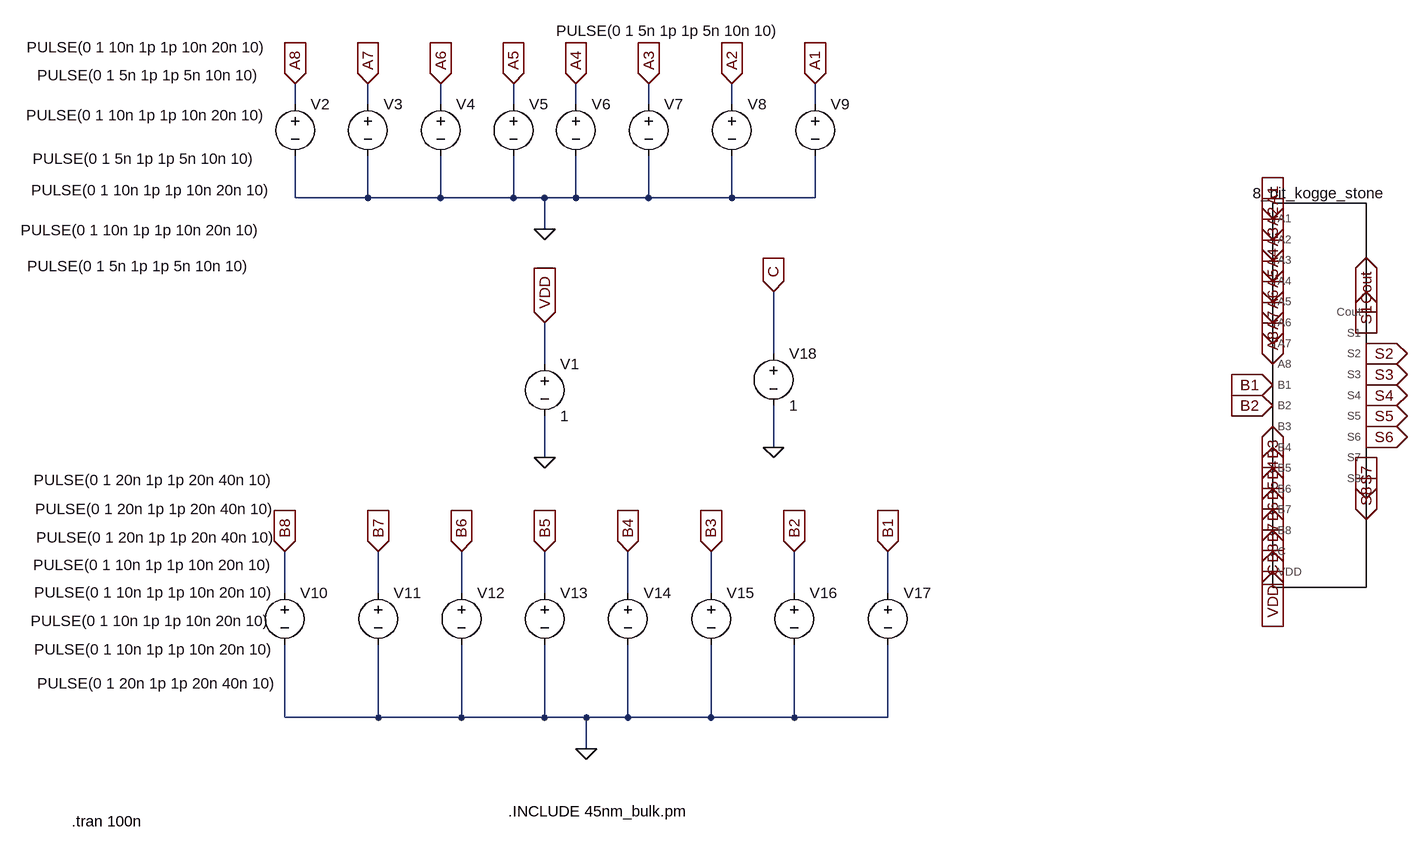
[diagram p0: schematic final_symbol_kogge_schematic.asc]
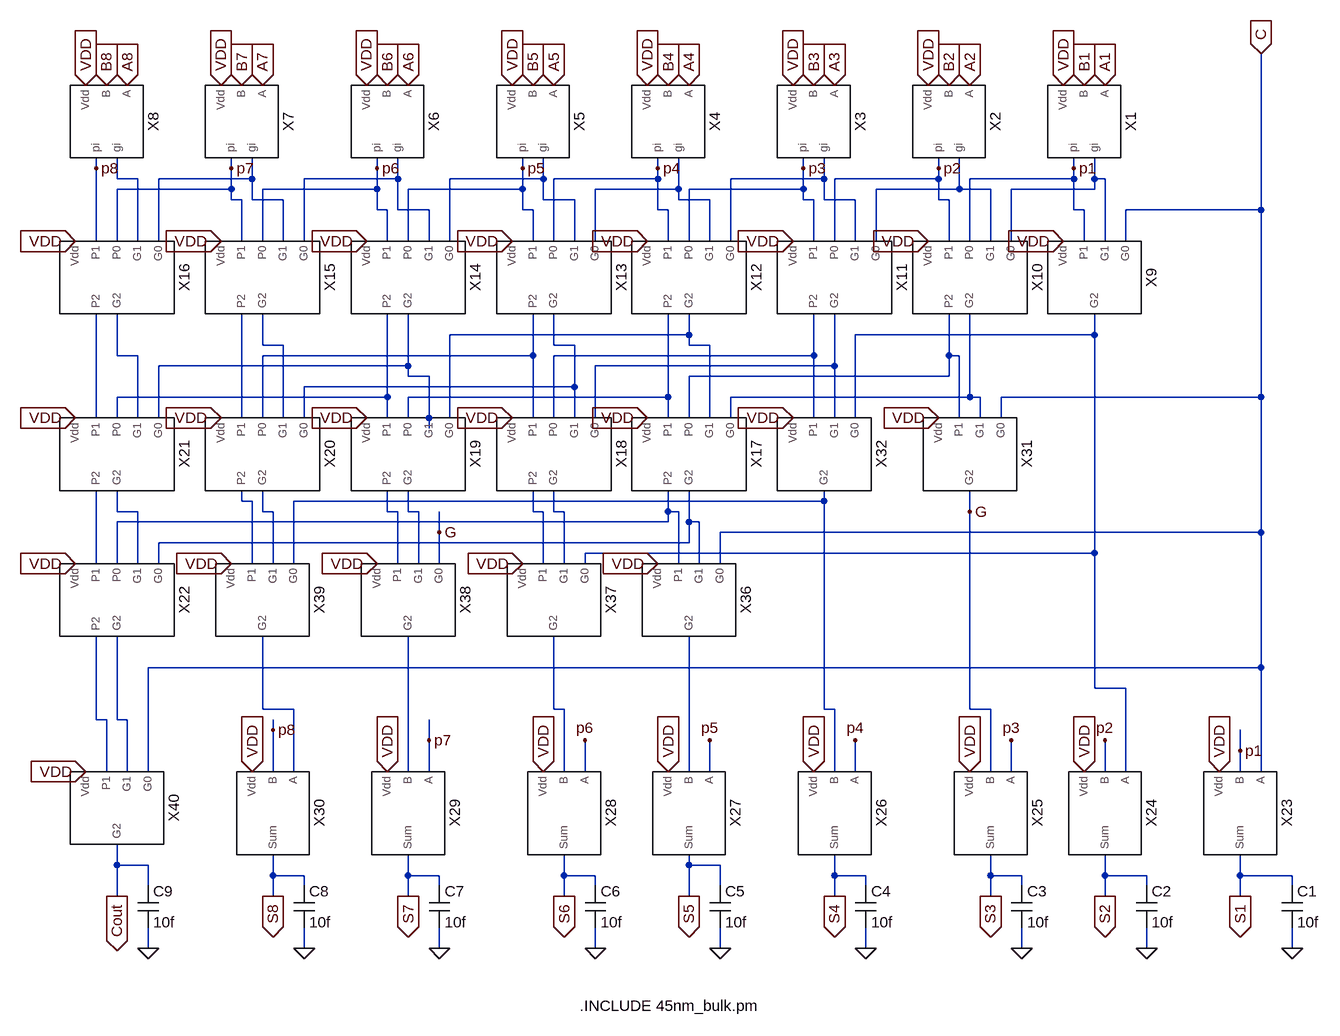
[diagram p1: sub-circuit 8bit_kogge_stone_final.asc]
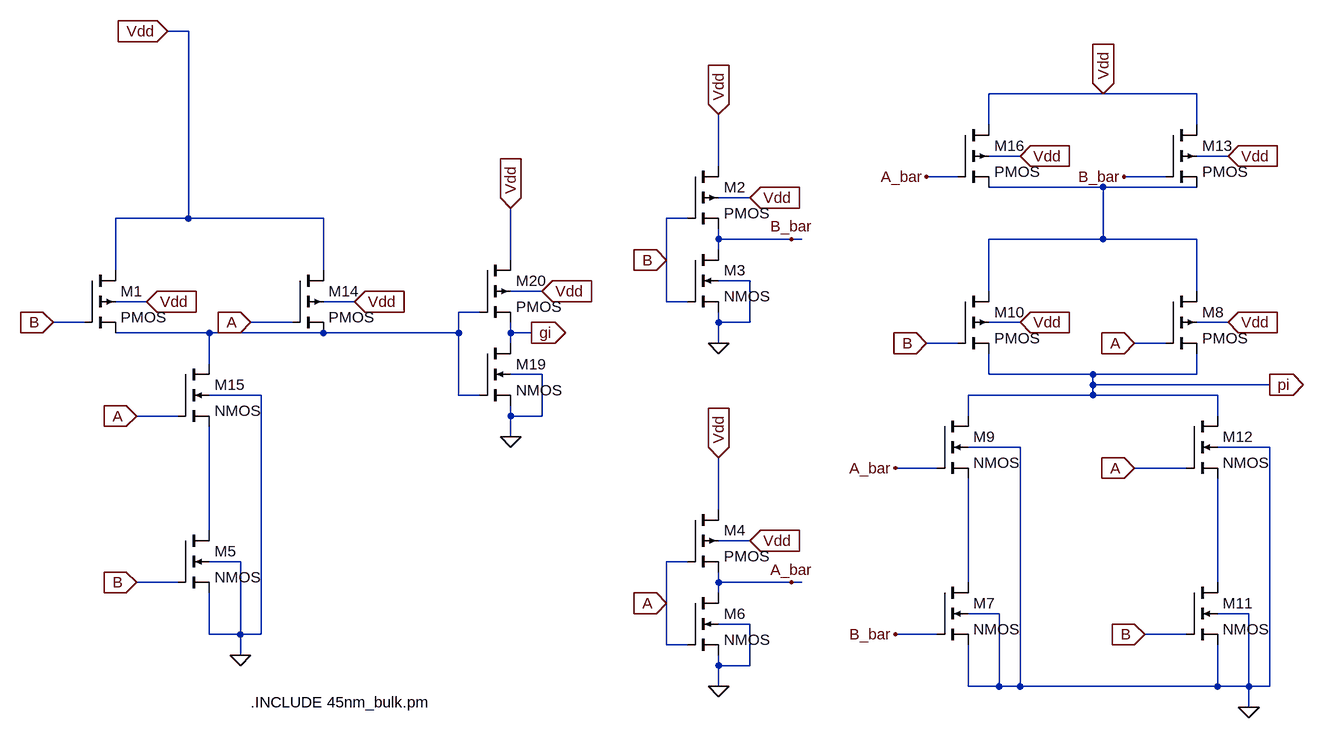
[diagram p2: sub-circuit bit_prop_gen.asc]
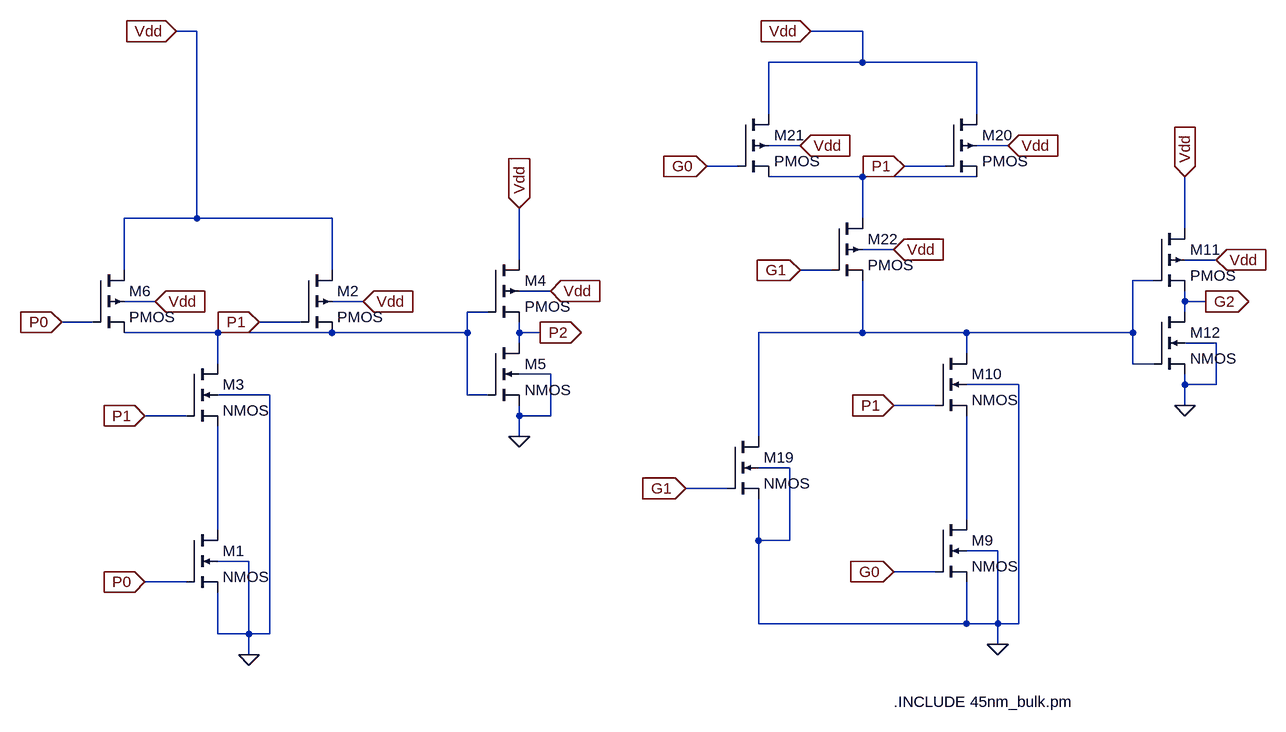
[diagram p3: sub-circuit group_prop_generate_both.asc]
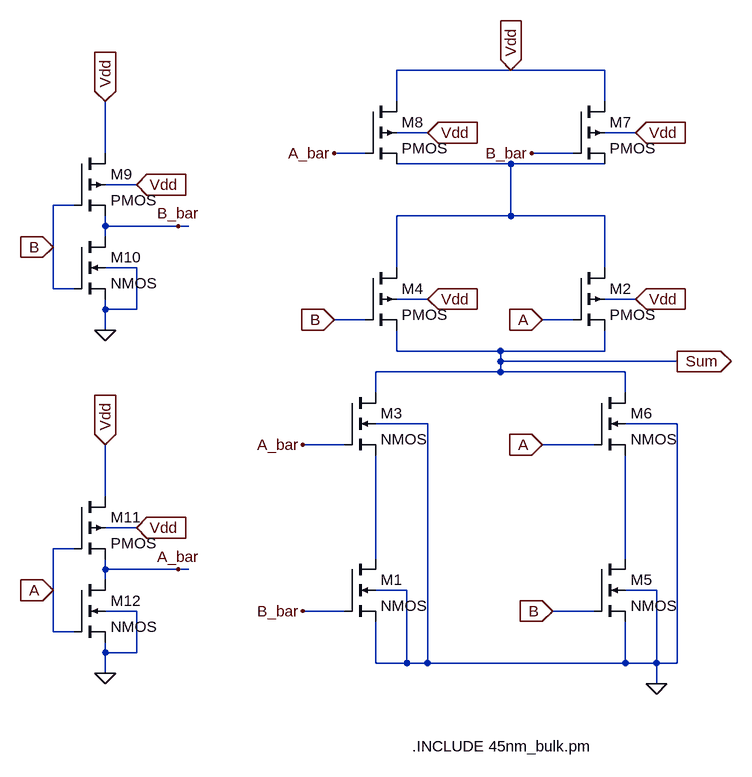
[diagram p4: sub-circuit xor_post_comp_sum.asc]
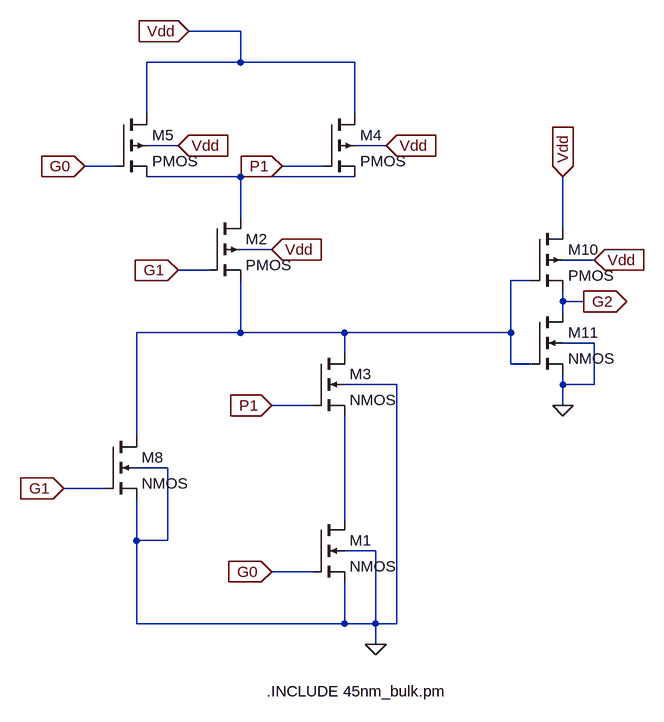
[diagram p5: sub-circuit group_generation.asc]
final_symbol_kogge_schematic.asc, the LTspice schematic file:
Version 4
SHEET 1 1920 1224
WIRE -384 -128 -384 -160
WIRE -272 -128 -272 -160
WIRE -160 -128 -160 -160
WIRE -48 -128 -48 -160
WIRE 48 -128 48 -160
WIRE 160 -128 160 -160
WIRE 288 -128 288 -160
WIRE 416 -128 416 -160
WIRE -384 16 -384 -48
WIRE -272 16 -272 -48
WIRE -272 16 -384 16
WIRE -160 16 -160 -48
WIRE -160 16 -272 16
WIRE -48 16 -48 -48
WIRE -48 16 -160 16
WIRE 0 16 -48 16
WIRE 48 16 48 -48
WIRE 48 16 0 16
WIRE 160 16 160 -48
WIRE 160 16 48 16
WIRE 288 16 288 -48
WIRE 288 16 160 16
WIRE 416 16 416 -48
WIRE 416 16 288 16
WIRE 0 64 0 16
WIRE 352 256 352 160
WIRE 0 272 0 208
WIRE 352 400 352 336
WIRE 0 416 0 352
WIRE -400 624 -400 560
WIRE -256 624 -256 560
WIRE -128 624 -128 560
WIRE 0 624 0 560
WIRE 128 624 128 560
WIRE 256 624 256 560
WIRE 384 624 384 560
WIRE 528 624 528 560
WIRE -400 816 -400 704
WIRE -256 816 -256 704
WIRE -256 816 -400 816
WIRE -128 816 -128 704
WIRE -128 816 -256 816
WIRE 0 816 0 704
WIRE 0 816 -128 816
WIRE 64 816 0 816
WIRE 128 816 128 704
WIRE 128 816 64 816
WIRE 256 816 256 704
WIRE 256 816 128 816
WIRE 384 816 384 704
WIRE 384 816 256 816
WIRE 528 816 528 704
WIRE 528 816 384 816
WIRE 64 864 64 816
FLAG 0 416 0
FLAG 0 208 VDD
IOPIN 0 208 In
FLAG 0 64 0
FLAG 416 -160 A1
IOPIN 416 -160 In
FLAG 288 -160 A2
IOPIN 288 -160 In
FLAG 160 -160 A3
IOPIN 160 -160 In
FLAG 48 -160 A4
IOPIN 48 -160 In
FLAG -48 -160 A5
IOPIN -48 -160 In
FLAG -160 -160 A6
IOPIN -160 -160 In
FLAG -272 -160 A7
IOPIN -272 -160 In
FLAG -384 -160 A8
IOPIN -384 -160 In
FLAG 64 864 0
FLAG 528 560 B1
IOPIN 528 560 In
FLAG 384 560 B2
IOPIN 384 560 In
FLAG 256 560 B3
IOPIN 256 560 In
FLAG 128 560 B4
IOPIN 128 560 In
FLAG 0 560 B5
IOPIN 0 560 In
FLAG -128 560 B6
IOPIN -128 560 In
FLAG -256 560 B7
IOPIN -256 560 In
FLAG -400 560 B8
IOPIN -400 560 In
FLAG 352 400 0
FLAG 352 160 C
IOPIN 352 160 In
FLAG 1120 48 A1
IOPIN 1120 48 In
FLAG 1120 80 A2
IOPIN 1120 80 In
FLAG 1120 112 A3
IOPIN 1120 112 In
FLAG 1120 144 A4
IOPIN 1120 144 In
FLAG 1120 176 A5
IOPIN 1120 176 In
FLAG 1120 208 A6
IOPIN 1120 208 In
FLAG 1120 240 A7
IOPIN 1120 240 In
FLAG 1120 272 A8
IOPIN 1120 272 In
FLAG 1120 304 B1
IOPIN 1120 304 In
FLAG 1120 336 B2
IOPIN 1120 336 In
FLAG 1120 368 B3
IOPIN 1120 368 In
FLAG 1120 400 B4
IOPIN 1120 400 In
FLAG 1120 432 B5
IOPIN 1120 432 In
FLAG 1120 464 B6
IOPIN 1120 464 In
FLAG 1120 496 B7
IOPIN 1120 496 In
FLAG 1120 528 B8
IOPIN 1120 528 In
FLAG 1120 560 C
IOPIN 1120 560 In
FLAG 1120 592 VDD
IOPIN 1120 592 In
FLAG 1264 192 Cout
IOPIN 1264 192 Out
FLAG 1264 224 S1
IOPIN 1264 224 Out
FLAG 1264 256 S2
IOPIN 1264 256 Out
FLAG 1264 288 S3
IOPIN 1264 288 Out
FLAG 1264 320 S4
IOPIN 1264 320 Out
FLAG 1264 384 S6
IOPIN 1264 384 Out
FLAG 1264 416 S7
IOPIN 1264 416 Out
FLAG 1264 448 S8
IOPIN 1264 448 Out
FLAG 1264 352 S5
IOPIN 1264 352 Out
SYMBOL voltage 0 256 R0
WINDOW 123 0 0 Left 0
WINDOW 39 0 0 Left 0
SYMATTR InstName V1
SYMATTR Value 1
SYMBOL voltage -384 -144 R0
WINDOW 3 -414 33 Left 2
WINDOW 123 0 0 Left 0
WINDOW 39 0 0 Left 0
SYMATTR Value PULSE(0 1 10n 1p 1p 10n 20n 10)
SYMATTR InstName V2
SYMBOL voltage -272 -144 R0
WINDOW 3 -509 -29 Left 2
WINDOW 123 0 0 Left 0
WINDOW 39 0 0 Left 0
SYMATTR Value PULSE(0 1 5n 1p 1p 5n 10n 10)
SYMATTR InstName V3
SYMBOL voltage -160 -144 R0
WINDOW 3 -646 210 Left 2
WINDOW 123 0 0 Left 0
WINDOW 39 0 0 Left 0
SYMATTR Value PULSE(0 1 10n 1p 1p 10n 20n 10)
SYMATTR InstName V4
SYMBOL voltage -48 -144 R0
WINDOW 3 -740 100 Left 2
WINDOW 123 0 0 Left 0
WINDOW 39 0 0 Left 0
SYMATTR Value PULSE(0 1 5n 1p 1p 5n 10n 10)
SYMATTR InstName V5
SYMBOL voltage 48 -144 R0
WINDOW 3 -838 148 Left 2
WINDOW 123 0 0 Left 0
WINDOW 39 0 0 Left 0
SYMATTR Value PULSE(0 1 10n 1p 1p 10n 20n 10)
SYMATTR InstName V6
SYMBOL voltage 160 -144 R0
WINDOW 3 -142 -97 Left 2
WINDOW 123 0 0 Left 0
WINDOW 39 0 0 Left 0
SYMATTR Value PULSE(0 1 5n 1p 1p 5n 10n 10)
SYMATTR InstName V7
SYMBOL voltage 288 -144 R0
WINDOW 3 -1085 -72 Left 2
WINDOW 123 0 0 Left 0
WINDOW 39 0 0 Left 0
SYMATTR Value PULSE(0 1 10n 1p 1p 10n 20n 10)
SYMATTR InstName V8
SYMBOL voltage 416 -144 R0
WINDOW 123 0 0 Left 0
WINDOW 39 0 0 Left 0
WINDOW 3 -1212 265 Left 2
SYMATTR InstName V9
SYMATTR Value PULSE(0 1 5n 1p 1p 5n 10n 10)
SYMBOL voltage -400 608 R0
WINDOW 3 -384 -113 Left 2
WINDOW 123 0 0 Left 0
WINDOW 39 0 0 Left 0
SYMATTR Value PULSE(0 1 20n 1p 1p 20n 40n 10)
SYMATTR InstName V10
SYMBOL voltage -256 608 R0
WINDOW 3 -535 59 Left 2
WINDOW 123 0 0 Left 0
WINDOW 39 0 0 Left 0
SYMATTR Value PULSE(0 1 10n 1p 1p 10n 20n 10)
SYMATTR InstName V11
SYMBOL voltage -128 608 R0
WINDOW 3 -658 -158 Left 2
WINDOW 123 0 0 Left 0
WINDOW 39 0 0 Left 0
SYMATTR Value PULSE(0 1 20n 1p 1p 20n 40n 10)
SYMATTR InstName V12
SYMBOL voltage 0 608 R0
WINDOW 3 -785 15 Left 2
WINDOW 123 0 0 Left 0
WINDOW 39 0 0 Left 0
SYMATTR Value PULSE(0 1 10n 1p 1p 10n 20n 10)
SYMATTR InstName V13
SYMBOL voltage 128 608 R0
WINDOW 3 -910 -69 Left 2
WINDOW 123 0 0 Left 0
WINDOW 39 0 0 Left 0
SYMATTR Value PULSE(0 1 20n 1p 1p 20n 40n 10)
SYMATTR InstName V14
SYMBOL voltage 256 608 R0
WINDOW 3 -1041 103 Left 2
WINDOW 123 0 0 Left 0
WINDOW 39 0 0 Left 0
SYMATTR Value PULSE(0 1 10n 1p 1p 10n 20n 10)
SYMATTR InstName V15
SYMBOL voltage 384 608 R0
WINDOW 3 -1165 155 Left 2
WINDOW 123 0 0 Left 0
WINDOW 39 0 0 Left 0
SYMATTR Value PULSE(0 1 20n 1p 1p 20n 40n 10)
SYMATTR InstName V16
SYMBOL voltage 528 608 R0
WINDOW 3 -1315 -27 Left 2
WINDOW 123 0 0 Left 0
WINDOW 39 0 0 Left 0
SYMATTR Value PULSE(0 1 10n 1p 1p 10n 20n 10)
SYMATTR InstName V17
SYMBOL voltage 352 240 R0
WINDOW 123 0 0 Left 0
WINDOW 39 0 0 Left 0
SYMATTR InstName V18
SYMATTR Value 1
SYMBOL 8BIT_KOGGE_STONE_FINAL 1184 320 R0
SYMATTR InstName 8_bit_kogge_stone
TEXT -56 960 Left 2 !.INCLUDE 45nm_bulk.pm
TEXT -728 976 Left 2 !.tran 100n

8bit_kogge_stone_final.asc, the sub-circuit schematic file:
Version 4
SHEET 1 1136 680
WIRE -752 -3680 -752 -3696
WIRE -544 -3680 -544 -3696
WIRE -320 -3680 -320 -3696
WIRE -96 -3680 -96 -3696
WIRE 112 -3680 112 -3696
WIRE 336 -3680 336 -3696
WIRE 544 -3680 544 -3696
WIRE 752 -3680 752 -3696
WIRE -720 -3664 -720 -3696
WIRE -688 -3664 -720 -3664
WIRE -512 -3664 -512 -3696
WIRE -512 -3664 -656 -3664
WIRE -288 -3664 -288 -3696
WIRE -288 -3664 -432 -3664
WIRE -64 -3664 -64 -3696
WIRE -64 -3664 -208 -3664
WIRE 112 -3664 112 -3680
WIRE 112 -3664 -48 -3664
WIRE 368 -3664 368 -3696
WIRE 368 -3664 224 -3664
WIRE 544 -3664 544 -3680
WIRE 544 -3664 384 -3664
WIRE 752 -3664 752 -3680
WIRE 752 -3664 592 -3664
WIRE 784 -3664 784 -3696
WIRE 800 -3664 784 -3664
WIRE -544 -3648 -544 -3680
WIRE -544 -3648 -720 -3648
WIRE -320 -3648 -320 -3680
WIRE -320 -3648 -496 -3648
WIRE -96 -3648 -96 -3680
WIRE -96 -3648 -272 -3648
WIRE 144 -3648 144 -3696
WIRE 144 -3648 16 -3648
WIRE 336 -3648 336 -3680
WIRE 336 -3648 160 -3648
WIRE 576 -3648 576 -3696
WIRE 576 -3648 448 -3648
WIRE 624 -3648 576 -3648
WIRE 784 -3648 784 -3664
WIRE 784 -3648 656 -3648
WIRE -544 -3632 -544 -3648
WIRE -528 -3632 -544 -3632
WIRE -512 -3632 -512 -3664
WIRE -464 -3632 -512 -3632
WIRE -64 -3632 -64 -3664
WIRE -16 -3632 -64 -3632
WIRE 144 -3632 144 -3648
WIRE 192 -3632 144 -3632
WIRE 336 -3632 336 -3648
WIRE 352 -3632 336 -3632
WIRE 368 -3632 368 -3664
WIRE 416 -3632 368 -3632
WIRE 544 -3632 544 -3664
WIRE 560 -3632 544 -3632
WIRE -320 -3616 -320 -3648
WIRE -304 -3616 -320 -3616
WIRE -288 -3616 -288 -3664
WIRE -240 -3616 -288 -3616
WIRE -96 -3616 -96 -3648
WIRE -80 -3616 -96 -3616
WIRE 112 -3616 112 -3664
WIRE 128 -3616 112 -3616
WIRE 752 -3616 752 -3664
WIRE 768 -3616 752 -3616
WIRE 1040 -3616 1040 -3856
WIRE 1040 -3616 832 -3616
WIRE -752 -3568 -752 -3680
WIRE -720 -3568 -720 -3648
WIRE -688 -3568 -688 -3664
WIRE -656 -3568 -656 -3664
WIRE -528 -3568 -528 -3632
WIRE -496 -3568 -496 -3648
WIRE -464 -3568 -464 -3632
WIRE -432 -3568 -432 -3664
WIRE -304 -3568 -304 -3616
WIRE -272 -3568 -272 -3648
WIRE -240 -3568 -240 -3616
WIRE -208 -3568 -208 -3664
WIRE -80 -3568 -80 -3616
WIRE -48 -3568 -48 -3664
WIRE -16 -3568 -16 -3632
WIRE 16 -3568 16 -3648
WIRE 128 -3568 128 -3616
WIRE 160 -3568 160 -3648
WIRE 192 -3568 192 -3632
WIRE 224 -3568 224 -3664
WIRE 352 -3568 352 -3632
WIRE 384 -3568 384 -3664
WIRE 416 -3568 416 -3632
WIRE 448 -3568 448 -3648
WIRE 560 -3568 560 -3632
WIRE 592 -3568 592 -3664
WIRE 624 -3568 624 -3648
WIRE 656 -3568 656 -3648
WIRE 768 -3568 768 -3616
WIRE 800 -3568 800 -3664
WIRE 832 -3568 832 -3616
WIRE 160 -3424 160 -3456
WIRE 160 -3424 -208 -3424
WIRE 784 -3424 784 -3456
WIRE 784 -3424 416 -3424
WIRE -496 -3408 -496 -3456
WIRE -464 -3408 -496 -3408
WIRE -48 -3408 -48 -3456
WIRE -16 -3408 -48 -3408
WIRE 160 -3408 160 -3424
WIRE 192 -3408 160 -3408
WIRE -720 -3392 -720 -3456
WIRE -688 -3392 -720 -3392
WIRE -80 -3392 -80 -3456
WIRE -80 -3392 -496 -3392
WIRE 352 -3392 352 -3456
WIRE 352 -3392 -48 -3392
WIRE 560 -3392 560 -3456
WIRE 576 -3392 560 -3392
WIRE -272 -3376 -272 -3456
WIRE -272 -3376 -656 -3376
WIRE 384 -3376 384 -3456
WIRE 384 -3376 16 -3376
WIRE -272 -3360 -272 -3376
WIRE -240 -3360 -272 -3360
WIRE 560 -3360 560 -3392
WIRE 560 -3360 160 -3360
WIRE -16 -3344 -16 -3408
WIRE -16 -3344 -432 -3344
WIRE -304 -3328 -304 -3456
WIRE -304 -3328 -720 -3328
WIRE 128 -3328 128 -3456
WIRE 128 -3328 -272 -3328
WIRE 592 -3328 592 -3456
WIRE 592 -3328 224 -3328
WIRE 608 -3328 592 -3328
WIRE 1040 -3328 1040 -3616
WIRE 1040 -3328 640 -3328
WIRE -752 -3296 -752 -3456
WIRE -720 -3296 -720 -3328
WIRE -688 -3296 -688 -3392
WIRE -656 -3296 -656 -3376
WIRE -528 -3296 -528 -3456
WIRE -496 -3296 -496 -3392
WIRE -464 -3296 -464 -3408
WIRE -432 -3296 -432 -3344
WIRE -304 -3296 -304 -3328
WIRE -272 -3296 -272 -3328
WIRE -240 -3296 -240 -3360
WIRE -208 -3296 -208 -3424
WIRE -80 -3296 -80 -3392
WIRE -48 -3296 -48 -3392
WIRE -16 -3296 -16 -3344
WIRE 16 -3296 16 -3376
WIRE 128 -3296 128 -3328
WIRE 160 -3296 160 -3360
WIRE 192 -3296 192 -3408
WIRE 224 -3296 224 -3328
WIRE 352 -3296 352 -3392
WIRE 384 -3296 384 -3376
WIRE 416 -3296 416 -3424
WIRE 576 -3296 576 -3392
WIRE 608 -3296 608 -3328
WIRE 640 -3296 640 -3328
WIRE -240 -3280 -240 -3296
WIRE -528 -3168 -528 -3184
WIRE -512 -3168 -528 -3168
WIRE 368 -3168 368 -3184
WIRE 368 -3168 -448 -3168
WIRE -720 -3152 -720 -3184
WIRE -688 -3152 -720 -3152
WIRE -496 -3152 -496 -3184
WIRE -480 -3152 -496 -3152
WIRE -304 -3152 -304 -3184
WIRE -288 -3152 -304 -3152
WIRE -272 -3152 -272 -3184
WIRE -256 -3152 -272 -3152
WIRE -80 -3152 -80 -3184
WIRE -64 -3152 -80 -3152
WIRE -48 -3152 -48 -3184
WIRE -32 -3152 -48 -3152
WIRE 128 -3152 128 -3184
WIRE 144 -3152 128 -3152
WIRE 592 -3152 592 -3184
WIRE 128 -3136 128 -3152
WIRE 128 -3136 -720 -3136
WIRE 160 -3136 160 -3184
WIRE 176 -3136 160 -3136
WIRE -224 -3120 -224 -3152
WIRE 1040 -3120 1040 -3328
WIRE 1040 -3120 208 -3120
WIRE 160 -3104 160 -3136
WIRE 160 -3104 -656 -3104
WIRE 784 -3088 784 -3424
WIRE 784 -3088 0 -3088
WIRE -752 -3072 -752 -3184
WIRE -720 -3072 -720 -3136
WIRE -688 -3072 -688 -3152
WIRE -656 -3072 -656 -3104
WIRE -512 -3072 -512 -3168
WIRE -480 -3072 -480 -3152
WIRE -448 -3072 -448 -3168
WIRE -288 -3072 -288 -3152
WIRE -256 -3072 -256 -3152
WIRE -224 -3072 -224 -3120
WIRE -64 -3072 -64 -3152
WIRE -32 -3072 -32 -3152
WIRE 0 -3072 0 -3088
WIRE 144 -3072 144 -3152
WIRE 176 -3072 176 -3136
WIRE 208 -3072 208 -3120
WIRE 1040 -2912 1040 -3120
WIRE 1040 -2912 -672 -2912
WIRE 784 -2880 784 -3088
WIRE 832 -2880 784 -2880
WIRE -496 -2848 -496 -2960
WIRE -448 -2848 -496 -2848
WIRE -48 -2848 -48 -2960
WIRE -32 -2848 -48 -2848
WIRE 368 -2848 368 -3168
WIRE 384 -2848 368 -2848
WIRE 592 -2848 592 -3152
WIRE 624 -2848 592 -2848
WIRE -752 -2832 -752 -2960
WIRE -736 -2832 -752 -2832
WIRE -720 -2832 -720 -2960
WIRE -704 -2832 -720 -2832
WIRE -480 -2816 -480 -2832
WIRE -240 -2800 -240 -2832
WIRE 1008 -2784 1008 -2816
WIRE -736 -2752 -736 -2832
WIRE -704 -2752 -704 -2832
WIRE -672 -2752 -672 -2912
WIRE -480 -2752 -480 -2816
WIRE -448 -2752 -448 -2848
WIRE -272 -2752 -272 -2960
WIRE -240 -2752 -240 -2800
WIRE -32 -2752 -32 -2848
WIRE 0 -2752 0 -2800
WIRE 160 -2752 160 -2960
WIRE 192 -2752 192 -2800
WIRE 384 -2752 384 -2848
WIRE 416 -2752 416 -2800
WIRE 624 -2752 624 -2848
WIRE 656 -2752 656 -2800
WIRE 800 -2752 800 -2800
WIRE 832 -2752 832 -2880
WIRE 1008 -2752 1008 -2784
WIRE 1040 -2752 1040 -2912
WIRE -720 -2608 -720 -2640
WIRE -672 -2608 -720 -2608
WIRE 160 -2608 160 -2624
WIRE 208 -2608 160 -2608
WIRE -480 -2592 -480 -2624
WIRE -432 -2592 -480 -2592
WIRE -272 -2592 -272 -2624
WIRE -224 -2592 -272 -2592
WIRE -32 -2592 -32 -2624
WIRE 16 -2592 -32 -2592
WIRE 384 -2592 384 -2624
WIRE 432 -2592 384 -2592
WIRE 624 -2592 624 -2624
WIRE 672 -2592 624 -2592
WIRE 800 -2592 800 -2624
WIRE 864 -2592 800 -2592
WIRE 1008 -2592 1008 -2624
WIRE 1088 -2592 1008 -2592
WIRE -672 -2576 -672 -2608
WIRE -432 -2576 -432 -2592
WIRE -224 -2576 -224 -2592
WIRE 16 -2576 16 -2592
WIRE 208 -2576 208 -2608
WIRE 432 -2576 432 -2592
WIRE 672 -2576 672 -2592
WIRE 864 -2576 864 -2592
WIRE 1088 -2576 1088 -2592
WIRE -720 -2560 -720 -2608
WIRE -480 -2560 -480 -2592
WIRE -272 -2560 -272 -2592
WIRE -32 -2560 -32 -2592
WIRE 160 -2560 160 -2608
WIRE 384 -2560 384 -2592
WIRE 624 -2560 624 -2592
WIRE 800 -2560 800 -2592
WIRE 1008 -2560 1008 -2592
WIRE -672 -2480 -672 -2512
WIRE -432 -2480 -432 -2512
WIRE -224 -2480 -224 -2512
WIRE 16 -2480 16 -2512
WIRE 208 -2480 208 -2512
WIRE 432 -2480 432 -2512
WIRE 672 -2480 672 -2512
WIRE 864 -2480 864 -2512
WIRE 1088 -2480 1088 -2512
FLAG -784 -3568 VDD
IOPIN -784 -3568 In
FLAG -560 -3568 VDD
IOPIN -560 -3568 In
FLAG -336 -3568 VDD
IOPIN -336 -3568 In
FLAG -112 -3568 VDD
IOPIN -112 -3568 In
FLAG 96 -3568 VDD
IOPIN 96 -3568 In
FLAG 320 -3568 VDD
IOPIN 320 -3568 In
FLAG 528 -3568 VDD
IOPIN 528 -3568 In
FLAG -784 -3296 VDD
IOPIN -784 -3296 In
FLAG -560 -3296 VDD
IOPIN -560 -3296 In
FLAG -336 -3296 VDD
IOPIN -336 -3296 In
FLAG -112 -3296 VDD
IOPIN -112 -3296 In
FLAG 96 -3296 VDD
IOPIN 96 -3296 In
FLAG 96 -3808 VDD
IOPIN 96 -3808 In
FLAG -112 -3808 VDD
IOPIN -112 -3808 In
FLAG -336 -3808 VDD
IOPIN -336 -3808 In
FLAG -560 -3808 VDD
IOPIN -560 -3808 In
FLAG -768 -3808 VDD
IOPIN -768 -3808 In
FLAG 320 -3808 VDD
IOPIN 320 -3808 In
FLAG 528 -3808 VDD
IOPIN 528 -3808 In
FLAG 736 -3808 VDD
IOPIN 736 -3808 In
FLAG -784 -3072 VDD
IOPIN -784 -3072 In
FLAG -512 -2752 VDD
IOPIN -512 -2752 In
FLAG -304 -2752 VDD
IOPIN -304 -2752 In
FLAG -64 -2752 VDD
IOPIN -64 -2752 In
FLAG 128 -2752 VDD
IOPIN 128 -2752 In
FLAG 352 -2752 VDD
IOPIN 352 -2752 In
FLAG 592 -2752 VDD
IOPIN 592 -2752 In
FLAG 768 -2752 VDD
IOPIN 768 -2752 In
FLAG 976 -2752 VDD
IOPIN 976 -2752 In
FLAG 800 -2800 p2
FLAG 656 -2800 p3
FLAG 112 -3680 p4
FLAG 416 -2800 p4
FLAG -96 -3680 p5
FLAG 192 -2800 p5
FLAG -320 -3680 p6
FLAG 0 -2800 p6
FLAG -544 -3680 p7
FLAG -752 -3680 p8
FLAG 768 -3808 B1
IOPIN 768 -3808 In
FLAG 560 -3808 B2
IOPIN 560 -3808 In
FLAG 352 -3808 B3
IOPIN 352 -3808 In
FLAG 128 -3808 B4
IOPIN 128 -3808 In
FLAG -80 -3808 B5
IOPIN -80 -3808 In
FLAG -304 -3808 B6
IOPIN -304 -3808 In
FLAG -528 -3808 B7
IOPIN -528 -3808 In
FLAG -736 -3808 B8
IOPIN -736 -3808 In
FLAG 800 -3808 A1
IOPIN 800 -3808 In
FLAG 592 -3808 A2
IOPIN 592 -3808 In
FLAG 384 -3808 A3
IOPIN 384 -3808 In
FLAG 160 -3808 A4
IOPIN 160 -3808 In
FLAG -48 -3808 A5
IOPIN -48 -3808 In
FLAG -272 -3808 A6
IOPIN -272 -3808 In
FLAG -496 -3808 A7
IOPIN -496 -3808 In
FLAG -704 -3808 A8
IOPIN -704 -3808 In
FLAG 1040 -3856 C
IOPIN 1040 -3856 In
FLAG 736 -3568 VDD
IOPIN 736 -3568 In
FLAG 544 -3296 VDD
IOPIN 544 -3296 In
FLAG 320 -3296 VDD
IOPIN 320 -3296 In
FLAG -544 -3072 VDD
IOPIN -544 -3072 In
FLAG -320 -3072 VDD
IOPIN -320 -3072 In
FLAG -96 -3072 VDD
IOPIN -96 -3072 In
FLAG 112 -3072 VDD
IOPIN 112 -3072 In
FLAG -768 -2752 VDD
IOPIN -768 -2752 In
FLAG 1008 -2560 S1
IOPIN 1008 -2560 Out
FLAG 800 -2560 S2
IOPIN 800 -2560 Out
FLAG 624 -2560 S3
IOPIN 624 -2560 Out
FLAG 384 -2560 S4
IOPIN 384 -2560 Out
FLAG 160 -2560 S5
IOPIN 160 -2560 Out
FLAG -32 -2560 S6
IOPIN -32 -2560 Out
FLAG -272 -2560 S7
IOPIN -272 -2560 Out
FLAG -480 -2560 S8
IOPIN -480 -2560 Out
FLAG -720 -2560 Cout
IOPIN -720 -2560 Out
FLAG 864 -2480 0
FLAG 672 -2480 0
FLAG 432 -2480 0
FLAG 208 -2480 0
FLAG 16 -2480 0
FLAG -224 -2480 0
FLAG -432 -2480 0
FLAG -672 -2480 0
FLAG 1088 -2480 0
FLAG 1008 -2784 p1
FLAG 752 -3680 p1
FLAG 544 -3680 p2
FLAG 336 -3680 p3
FLAG 592 -3152 G
FLAG -224 -3120 G
FLAG -240 -2800 p7
FLAG -480 -2816 p8
SYMBOL bit_prop_gen 768 -3760 R90
SYMATTR InstName X1
SYMBOL bit_prop_gen 560 -3760 R90
SYMATTR InstName X2
SYMBOL bit_prop_gen 352 -3760 R90
SYMATTR InstName X3
SYMBOL bit_prop_gen 128 -3760 R90
SYMATTR InstName X4
SYMBOL bit_prop_gen -80 -3760 R90
SYMATTR InstName X5
SYMBOL bit_prop_gen -304 -3760 R90
SYMATTR InstName X6
SYMBOL bit_prop_gen -528 -3760 R90
SYMATTR InstName X7
SYMBOL bit_prop_gen -736 -3760 R90
SYMATTR InstName X8
SYMBOL group_prop_generate_both 592 -3520 R90
SYMATTR InstName X10
SYMBOL group_prop_generate_both 384 -3520 R90
SYMATTR InstName X11
SYMBOL group_prop_generate_both 160 -3520 R90
SYMATTR InstName X12
SYMBOL group_prop_generate_both -48 -3520 R90
SYMATTR InstName X13
SYMBOL group_prop_generate_both -272 -3520 R90
SYMATTR InstName X14
SYMBOL group_prop_generate_both -496 -3520 R90
SYMATTR InstName X15
SYMBOL group_prop_generate_both -720 -3520 R90
SYMATTR InstName X16
SYMBOL group_prop_generate_both 160 -3248 R90
SYMATTR InstName X17
SYMBOL group_prop_generate_both -48 -3248 R90
SYMATTR InstName X18
SYMBOL group_prop_generate_both -272 -3248 R90
SYMATTR InstName X19
SYMBOL group_prop_generate_both -496 -3248 R90
SYMATTR InstName X20
SYMBOL group_prop_generate_both -720 -3248 R90
SYMATTR InstName X21
SYMBOL group_prop_generate_both -720 -3024 R90
SYMATTR InstName X22
SYMBOL xor_post_comp_sum 1008 -2688 R90
SYMATTR InstName X23
SYMBOL xor_post_comp_sum 800 -2688 R90
SYMATTR InstName X24
SYMBOL xor_post_comp_sum 624 -2688 R90
SYMATTR InstName X25
SYMBOL xor_post_comp_sum 384 -2688 R90
SYMATTR InstName X26
SYMBOL xor_post_comp_sum 160 -2688 R90
SYMATTR InstName X27
SYMBOL xor_post_comp_sum -32 -2688 R90
SYMATTR InstName X28
SYMBOL xor_post_comp_sum -272 -2688 R90
SYMATTR InstName X29
SYMBOL xor_post_comp_sum -480 -2688 R90
SYMATTR InstName X30
SYMBOL group_generation 784 -3520 R90
SYMATTR InstName X9
SYMBOL group_generation 592 -3248 R90
SYMATTR InstName X31
SYMBOL group_generation 368 -3248 R90
SYMATTR InstName X32
SYMBOL group_generation 160 -3024 R90
SYMATTR InstName X36
SYMBOL group_generation -48 -3024 R90
SYMATTR InstName X37
SYMBOL group_generation -272 -3024 R90
SYMATTR InstName X38
SYMBOL group_generation -496 -3024 R90
SYMATTR InstName X39
SYMBOL group_generation -720 -2704 R90
SYMATTR InstName X40
SYMBOL cap 1072 -2576 R0
SYMATTR InstName C1
SYMATTR Value 10f
SYMBOL cap 848 -2576 R0
SYMATTR InstName C2
SYMATTR Value 10f
SYMBOL cap 656 -2576 R0
SYMATTR InstName C3
SYMATTR Value 10f
SYMBOL cap 416 -2576 R0
SYMATTR InstName C4
SYMATTR Value 10f
SYMBOL cap 192 -2576 R0
SYMATTR InstName C5
SYMATTR Value 10f
SYMBOL cap 0 -2576 R0
SYMATTR InstName C6
SYMATTR Value 10f
SYMBOL cap -240 -2576 R0
SYMATTR InstName C7
SYMATTR Value 10f
SYMBOL cap -448 -2576 R0
SYMATTR InstName C8
SYMATTR Value 10f
SYMBOL cap -688 -2576 R0
SYMATTR InstName C9
SYMATTR Value 10f
TEXT -8 -2392 Left 2 !.INCLUDE 45nm_bulk.pm

bit_prop_gen.asc, the sub-circuit schematic file:
Version 4
SHEET 1 1744 680
WIRE -480 -848 -512 -848
WIRE 928 -752 752 -752
WIRE 1072 -752 928 -752
WIRE 752 -704 752 -752
WIRE 1072 -704 1072 -752
WIRE 800 -656 752 -656
WIRE 1120 -656 1072 -656
WIRE 336 -640 336 -720
WIRE 704 -624 656 -624
WIRE 1024 -624 960 -624
WIRE 928 -608 752 -608
WIRE 1072 -608 928 -608
WIRE 384 -592 336 -592
WIRE -480 -560 -480 -848
WIRE -480 -560 -592 -560
WIRE -272 -560 -480 -560
WIRE 288 -560 256 -560
WIRE 336 -528 336 -544
WIRE 448 -528 336 -528
WIRE 464 -528 448 -528
WIRE 928 -528 928 -608
WIRE 928 -528 752 -528
WIRE 1072 -528 928 -528
WIRE 336 -512 336 -528
WIRE 16 -496 16 -576
WIRE 256 -496 256 -560
WIRE -592 -480 -592 -560
WIRE -272 -480 -272 -560
WIRE 384 -464 336 -464
WIRE 64 -448 16 -448
WIRE 752 -448 752 -528
WIRE 1072 -448 1072 -528
WIRE -544 -432 -592 -432
WIRE -224 -432 -272 -432
WIRE 256 -432 256 -496
WIRE 288 -432 256 -432
WIRE -32 -416 -64 -416
WIRE -640 -400 -688 -400
WIRE -320 -400 -384 -400
WIRE 336 -400 336 -416
WIRE 384 -400 384 -464
WIRE 384 -400 336 -400
WIRE 800 -400 752 -400
WIRE 1120 -400 1072 -400
WIRE -448 -384 -592 -384
WIRE -272 -384 -448 -384
WIRE -64 -384 -64 -416
WIRE -64 -384 -272 -384
WIRE 16 -384 16 -400
WIRE 48 -384 16 -384
WIRE 16 -368 16 -384
WIRE 336 -368 336 -400
WIRE 704 -368 656 -368
WIRE 1024 -368 976 -368
WIRE -448 -336 -448 -384
WIRE 64 -320 16 -320
WIRE 752 -320 752 -352
WIRE 912 -320 752 -320
WIRE 1072 -320 1072 -352
WIRE 1072 -320 912 -320
WIRE 912 -304 912 -320
WIRE 1184 -304 912 -304
WIRE -368 -288 -448 -288
WIRE -64 -288 -64 -384
WIRE -32 -288 -64 -288
WIRE 912 -288 912 -304
WIRE 912 -288 720 -288
WIRE 1104 -288 912 -288
WIRE -496 -256 -560 -256
WIRE 16 -256 16 -272
WIRE 64 -256 64 -320
WIRE 64 -256 16 -256
WIRE 720 -256 720 -288
WIRE 1104 -256 1104 -288
WIRE 16 -224 16 -256
WIRE 800 -208 720 -208
WIRE 1184 -208 1104 -208
WIRE 672 -176 608 -176
WIRE 1056 -176 976 -176
WIRE 336 -112 336 -192
WIRE -448 -80 -448 -240
WIRE 384 -64 336 -64
WIRE -400 -32 -448 -32
WIRE 288 -32 256 -32
WIRE -496 0 -560 0
WIRE 336 0 336 -16
WIRE 448 0 336 0
WIRE 464 0 448 0
WIRE 720 0 720 -160
WIRE 1104 0 1104 -160
WIRE 336 16 336 0
WIRE 256 32 256 -32
WIRE 768 48 720 48
WIRE 1152 48 1104 48
WIRE 384 64 336 64
WIRE -448 80 -448 16
WIRE -400 80 -400 -32
WIRE -400 80 -448 80
WIRE -368 80 -368 -288
WIRE -368 80 -400 80
WIRE 672 80 608 80
WIRE 1056 80 992 80
WIRE 256 96 256 32
WIRE 288 96 256 96
WIRE -400 112 -400 80
WIRE 336 128 336 112
WIRE 384 128 384 64
WIRE 384 128 336 128
WIRE 336 160 336 128
WIRE 720 160 720 96
WIRE 768 160 768 48
WIRE 768 160 720 160
WIRE 800 160 800 -208
WIRE 800 160 768 160
WIRE 1104 160 1104 96
WIRE 1104 160 800 160
WIRE 1152 160 1152 48
WIRE 1152 160 1104 160
WIRE 1184 160 1184 -208
WIRE 1184 160 1152 160
WIRE 1152 192 1152 160
FLAG -560 0 B
IOPIN -560 0 In
FLAG -512 -848 Vdd
IOPIN -512 -848 In
FLAG 16 -576 Vdd
IOPIN 16 -576 In
FLAG -224 -432 Vdd
IOPIN -224 -432 In
FLAG 64 -448 Vdd
IOPIN 64 -448 In
FLAG 48 -384 gi
IOPIN 48 -384 Out
FLAG -688 -400 B
IOPIN -688 -400 In
FLAG -544 -432 Vdd
IOPIN -544 -432 In
FLAG -400 112 0
FLAG 16 -224 0
FLAG 336 -720 Vdd
IOPIN 336 -720 In
FLAG 384 -592 Vdd
IOPIN 384 -592 In
FLAG 336 -368 0
FLAG 336 -192 Vdd
IOPIN 336 -192 In
FLAG 384 -64 Vdd
IOPIN 384 -64 In
FLAG 336 160 0
FLAG 256 -496 B
IOPIN 256 -496 In
FLAG 256 32 A
IOPIN 256 32 In
FLAG 976 -368 A
IOPIN 976 -368 In
FLAG 1120 -400 Vdd
IOPIN 1120 -400 In
FLAG 656 -368 B
IOPIN 656 -368 In
FLAG 800 -400 Vdd
IOPIN 800 -400 In
FLAG 992 80 B
IOPIN 992 80 In
FLAG 976 -176 A
IOPIN 976 -176 In
FLAG 1152 192 0
FLAG 1120 -656 Vdd
IOPIN 1120 -656 In
FLAG 800 -656 Vdd
IOPIN 800 -656 In
FLAG 448 -528 B_bar
FLAG 960 -624 B_bar
FLAG 608 80 B_bar
FLAG 448 0 A_bar
FLAG 656 -624 A_bar
FLAG 608 -176 A_bar
FLAG 928 -752 Vdd
IOPIN 928 -752 In
FLAG 1184 -304 pi
IOPIN 1184 -304 Out
FLAG -384 -400 A
IOPIN -384 -400 In
FLAG -560 -256 A
IOPIN -560 -256 In
SYMBOL nmos4 -496 -80 R0
SYMATTR InstName M5
SYMATTR Value2 l=45n w=90n
SYMBOL pmos4 -320 -480 R0
SYMATTR InstName M14
SYMATTR Value2 l=45n w=90n
SYMBOL nmos4 -496 -336 R0
SYMATTR InstName M15
SYMATTR Value2 l=45n w=90n
SYMBOL pmos4 -32 -496 R0
SYMATTR InstName M20
SYMATTR Value2 l=45n w=90n
SYMBOL nmos4 -32 -368 R0
SYMATTR InstName M19
SYMATTR Value2 l=45n w=45n
SYMBOL pmos4 -640 -480 R0
SYMATTR InstName M1
SYMATTR Value2 l=45n w=90n
SYMBOL pmos4 288 -640 R0
SYMATTR InstName M2
SYMATTR Value2 l=45n w=90n
SYMBOL nmos4 288 -512 R0
SYMATTR InstName M3
SYMATTR Value2 l=45n w=45n
SYMBOL pmos4 288 -112 R0
SYMATTR InstName M4
SYMATTR Value2 l=45n w=90n
SYMBOL nmos4 288 16 R0
SYMATTR InstName M6
SYMATTR Value2 l=45n w=45n
SYMBOL nmos4 672 0 R0
SYMATTR InstName M7
SYMATTR Value2 l=45n w=90n
SYMBOL pmos4 1024 -448 R0
SYMATTR InstName M8
SYMATTR Value2 l=45n w=180n
SYMBOL nmos4 672 -256 R0
SYMATTR InstName M9
SYMATTR Value2 l=45n w=90n
SYMBOL pmos4 704 -448 R0
SYMATTR InstName M10
SYMATTR Value2 l=45n w=180n
SYMBOL nmos4 1056 0 R0
SYMATTR InstName M11
SYMATTR Value2 l=45n w=90n
SYMBOL nmos4 1056 -256 R0
SYMATTR InstName M12
SYMATTR Value2 l=45n w=90n
SYMBOL pmos4 1024 -704 R0
SYMATTR InstName M13
SYMATTR Value2 l=45n w=180n
SYMBOL pmos4 704 -704 R0
SYMATTR InstName M16
SYMATTR Value2 l=45n w=180n
TEXT -384 184 Left 2 !.INCLUDE 45nm_bulk.pm

group_prop_generate_both.asc, the sub-circuit schematic file:
Version 4
SHEET 1 3740 836
WIRE 1968 -448 1936 -448
WIRE 2992 -448 2912 -448
WIRE 2992 -400 2992 -448
WIRE 2992 -400 2848 -400
WIRE 3168 -400 2992 -400
WIRE 2848 -320 2848 -400
WIRE 3168 -320 3168 -400
WIRE 2896 -272 2848 -272
WIRE 3216 -272 3168 -272
WIRE 2800 -240 2752 -240
WIRE 3120 -240 3056 -240
WIRE 2992 -224 2848 -224
WIRE 3168 -224 2992 -224
WIRE 1968 -160 1968 -448
WIRE 1968 -160 1856 -160
WIRE 2176 -160 1968 -160
WIRE 2992 -160 2992 -224
WIRE 3488 -144 3488 -224
WIRE 3040 -112 2992 -112
WIRE 2464 -96 2464 -176
WIRE 3536 -96 3488 -96
WIRE 1856 -80 1856 -160
WIRE 2176 -80 2176 -160
WIRE 2944 -80 2896 -80
WIRE 3440 -64 3408 -64
WIRE 2512 -48 2464 -48
WIRE 1904 -32 1856 -32
WIRE 2224 -32 2176 -32
WIRE 3488 -32 3488 -48
WIRE 3520 -32 3488 -32
WIRE 2416 -16 2384 -16
WIRE 3488 -16 3488 -32
WIRE 1808 0 1760 0
WIRE 2128 0 2064 0
WIRE 2000 16 1856 16
WIRE 2176 16 2000 16
WIRE 2384 16 2384 -16
WIRE 2384 16 2176 16
WIRE 2464 16 2464 0
WIRE 2496 16 2464 16
WIRE 2992 16 2992 -64
WIRE 2992 16 2832 16
WIRE 3152 16 2992 16
WIRE 3408 16 3408 -64
WIRE 3408 16 3152 16
WIRE 2464 32 2464 16
WIRE 3536 32 3488 32
WIRE 3152 48 3152 16
WIRE 2000 64 2000 16
WIRE 3408 64 3408 16
WIRE 3440 64 3408 64
WIRE 2512 80 2464 80
WIRE 3232 96 3152 96
WIRE 3488 96 3488 80
WIRE 3536 96 3536 32
WIRE 3536 96 3488 96
WIRE 2080 112 2000 112
WIRE 2384 112 2384 16
WIRE 2416 112 2384 112
WIRE 3104 128 3040 128
WIRE 3488 128 3488 96
WIRE 1952 144 1888 144
WIRE 2464 144 2464 128
WIRE 2512 144 2512 80
WIRE 2512 144 2464 144
WIRE 2464 176 2464 144
WIRE 2832 176 2832 16
WIRE 2880 224 2832 224
WIRE 2784 256 2720 256
WIRE 3152 304 3152 144
WIRE 2000 320 2000 160
WIRE 2832 336 2832 272
WIRE 2880 336 2880 224
WIRE 2880 336 2832 336
WIRE 3200 352 3152 352
WIRE 2048 368 2000 368
WIRE 3104 384 3040 384
WIRE 1952 400 1888 400
WIRE 2832 464 2832 336
WIRE 3152 464 3152 400
WIRE 3152 464 2832 464
WIRE 3200 464 3200 352
WIRE 3200 464 3152 464
WIRE 3232 464 3232 96
WIRE 3232 464 3200 464
WIRE 2000 480 2000 416
WIRE 2048 480 2048 368
WIRE 2048 480 2000 480
WIRE 2080 480 2080 112
WIRE 2080 480 2048 480
WIRE 3200 496 3200 464
WIRE 2048 512 2048 480
FLAG 3040 384 G0
IOPIN 3040 384 In
FLAG 3040 128 P1
IOPIN 3040 128 In
FLAG 2912 -448 Vdd
IOPIN 2912 -448 In
FLAG 3200 496 0
FLAG 3488 -224 Vdd
IOPIN 3488 -224 In
FLAG 3536 -96 Vdd
IOPIN 3536 -96 In
FLAG 3520 -32 G2
IOPIN 3520 -32 Out
FLAG 3488 128 0
FLAG 2720 256 G1
IOPIN 2720 256 In
FLAG 3216 -272 Vdd
IOPIN 3216 -272 In
FLAG 2752 -240 G0
IOPIN 2752 -240 In
FLAG 2896 -272 Vdd
IOPIN 2896 -272 In
FLAG 2896 -80 G1
IOPIN 2896 -80 In
FLAG 3040 -112 Vdd
IOPIN 3040 -112 In
FLAG 3056 -240 P1
IOPIN 3056 -240 In
FLAG 1888 400 P0
IOPIN 1888 400 In
FLAG 1936 -448 Vdd
IOPIN 1936 -448 In
FLAG 2464 -176 Vdd
IOPIN 2464 -176 In
FLAG 2224 -32 Vdd
IOPIN 2224 -32 In
FLAG 2512 -48 Vdd
IOPIN 2512 -48 In
FLAG 2496 16 P2
IOPIN 2496 16 Out
FLAG 1760 0 P0
IOPIN 1760 0 In
FLAG 1904 -32 Vdd
IOPIN 1904 -32 In
FLAG 2048 512 0
FLAG 2464 176 0
FLAG 2064 0 P1
IOPIN 2064 0 In
FLAG 1888 144 P1
IOPIN 1888 144 In
SYMBOL nmos4 3104 304 R0
SYMATTR InstName M9
SYMATTR Value2 l=45n w=90n
SYMBOL nmos4 3104 48 R0
SYMATTR InstName M10
SYMATTR Value2 l=45n w=90n
SYMBOL pmos4 3440 -144 R0
SYMATTR InstName M11
SYMATTR Value2 l=45n w=90n
SYMBOL nmos4 3440 -16 R0
SYMATTR InstName M12
SYMATTR Value2 l=45n w=45n
SYMBOL nmos4 2784 176 R0
SYMATTR InstName M19
SYMATTR Value2 l=45n w=45n
SYMBOL pmos4 3120 -320 R0
SYMATTR InstName M20
SYMATTR Value2 l=45n w=180n
SYMBOL pmos4 2800 -320 R0
SYMATTR InstName M21
SYMATTR Value2 l=45n w=180n
SYMBOL pmos4 2944 -160 R0
SYMATTR InstName M22
SYMATTR Value2 l=45n w=180n
SYMBOL nmos4 1952 320 R0
SYMATTR InstName M1
SYMATTR Value2 l=45n w=90n
SYMBOL pmos4 2128 -80 R0
SYMATTR InstName M2
SYMATTR Value2 l=45n w=90n
SYMBOL nmos4 1952 64 R0
SYMATTR InstName M3
SYMATTR Value2 l=45n w=90n
SYMBOL pmos4 2416 -96 R0
SYMATTR InstName M4
SYMATTR Value2 l=45n w=90n
SYMBOL nmos4 2416 32 R0
SYMATTR InstName M5
SYMATTR Value2 l=45n w=45n
SYMBOL pmos4 1808 -80 R0
SYMATTR InstName M6
SYMATTR Value2 l=45n w=90n
TEXT 3040 584 Left 2 !.INCLUDE 45nm_bulk.pm

xor_post_comp_sum.asc, the sub-circuit schematic file:
Version 4
SHEET 1 880 864
WIRE 288 -192 112 -192
WIRE 432 -192 288 -192
WIRE 112 -144 112 -192
WIRE 432 -144 432 -192
WIRE 160 -96 112 -96
WIRE 480 -96 432 -96
WIRE -336 -64 -336 -144
WIRE 64 -64 16 -64
WIRE 384 -64 320 -64
WIRE 288 -48 112 -48
WIRE 432 -48 288 -48
WIRE -288 -16 -336 -16
WIRE -384 16 -416 16
WIRE 288 32 288 -48
WIRE 288 32 112 32
WIRE 432 32 288 32
WIRE -336 48 -336 32
WIRE -224 48 -336 48
WIRE -208 48 -224 48
WIRE -336 64 -336 48
WIRE -416 80 -416 16
WIRE -288 112 -336 112
WIRE 112 112 112 32
WIRE 432 112 432 32
WIRE -416 144 -416 80
WIRE -384 144 -416 144
WIRE 160 160 112 160
WIRE 480 160 432 160
WIRE -336 176 -336 160
WIRE -288 176 -288 112
WIRE -288 176 -336 176
WIRE 64 192 16 192
WIRE 384 192 336 192
WIRE -336 208 -336 176
WIRE 112 240 112 208
WIRE 272 240 112 240
WIRE 432 240 432 208
WIRE 432 240 272 240
WIRE 272 256 272 240
WIRE 544 256 272 256
WIRE 272 272 272 256
WIRE 272 272 80 272
WIRE 464 272 272 272
WIRE 80 304 80 272
WIRE 464 304 464 272
WIRE 160 352 80 352
WIRE 544 352 464 352
WIRE 32 384 -32 384
WIRE 416 384 336 384
WIRE -336 464 -336 384
WIRE -288 512 -336 512
WIRE -384 544 -416 544
WIRE 80 560 80 400
WIRE 464 560 464 400
WIRE -336 576 -336 560
WIRE -224 576 -336 576
WIRE -208 576 -224 576
WIRE -336 592 -336 576
WIRE -416 608 -416 544
WIRE 128 608 80 608
WIRE 512 608 464 608
WIRE -288 640 -336 640
WIRE 32 640 -32 640
WIRE 416 640 352 640
WIRE -416 672 -416 608
WIRE -384 672 -416 672
WIRE -336 704 -336 688
WIRE -288 704 -288 640
WIRE -288 704 -336 704
WIRE 80 720 80 656
WIRE 128 720 128 608
WIRE 128 720 80 720
WIRE 160 720 160 352
WIRE 160 720 128 720
WIRE 464 720 464 656
WIRE 464 720 160 720
WIRE 512 720 512 608
WIRE 512 720 464 720
WIRE 544 720 544 352
WIRE 544 720 512 720
WIRE -336 736 -336 704
WIRE 512 752 512 720
FLAG 336 192 A
IOPIN 336 192 In
FLAG 480 160 Vdd
IOPIN 480 160 In
FLAG 16 192 B
IOPIN 16 192 In
FLAG 160 160 Vdd
IOPIN 160 160 In
FLAG 352 640 B
IOPIN 352 640 In
FLAG 336 384 A
IOPIN 336 384 In
FLAG 512 752 0
FLAG 480 -96 Vdd
IOPIN 480 -96 In
FLAG 160 -96 Vdd
IOPIN 160 -96 In
FLAG 320 -64 B_bar
FLAG -32 640 B_bar
FLAG 16 -64 A_bar
FLAG -32 384 A_bar
FLAG 288 -192 Vdd
IOPIN 288 -192 In
FLAG 544 256 Sum
IOPIN 544 256 Out
FLAG -336 -144 Vdd
IOPIN -336 -144 In
FLAG -288 -16 Vdd
IOPIN -288 -16 In
FLAG -336 208 0
FLAG -336 384 Vdd
IOPIN -336 384 In
FLAG -288 512 Vdd
IOPIN -288 512 In
FLAG -336 736 0
FLAG -416 80 B
IOPIN -416 80 In
FLAG -416 608 A
IOPIN -416 608 In
FLAG -224 48 B_bar
FLAG -224 576 A_bar
SYMBOL nmos4 32 560 R0
SYMATTR InstName M1
SYMATTR Value2 l=45n w=90n
SYMBOL pmos4 384 112 R0
SYMATTR InstName M2
SYMATTR Value2 l=45n w=180n
SYMBOL nmos4 32 304 R0
SYMATTR InstName M3
SYMATTR Value2 l=45n w=90n
SYMBOL pmos4 64 112 R0
SYMATTR InstName M4
SYMATTR Value2 l=45n w=180n
SYMBOL nmos4 416 560 R0
SYMATTR InstName M5
SYMATTR Value2 l=45n w=90n
SYMBOL nmos4 416 304 R0
SYMATTR InstName M6
SYMATTR Value2 l=45n w=90n
SYMBOL pmos4 384 -144 R0
SYMATTR InstName M7
SYMATTR Value2 l=45n w=180n
SYMBOL pmos4 64 -144 R0
SYMATTR InstName M8
SYMATTR Value2 l=45n w=180n
SYMBOL pmos4 -384 -64 R0
SYMATTR InstName M9
SYMATTR Value2 l=45n w=90n
SYMBOL nmos4 -384 64 R0
SYMATTR InstName M10
SYMATTR Value2 l=45n w=45n
SYMBOL pmos4 -384 464 R0
SYMATTR InstName M11
SYMATTR Value2 l=45n w=90n
SYMBOL nmos4 -384 592 R0
SYMATTR InstName M12
SYMATTR Value2 l=45n w=45n
TEXT 136 848 Left 2 !.INCLUDE 45nm_bulk.pm

group_generation.asc, the sub-circuit schematic file:
Version 4
SHEET 1 1608 792
WIRE -128 -256 -208 -256
WIRE -128 -208 -128 -256
WIRE -128 -208 -272 -208
WIRE 48 -208 -128 -208
WIRE -272 -128 -272 -208
WIRE 48 -128 48 -208
WIRE -224 -80 -272 -80
WIRE 96 -80 48 -80
WIRE -320 -48 -368 -48
WIRE 0 -48 -64 -48
WIRE -128 -32 -272 -32
WIRE 48 -32 -128 -32
WIRE -128 32 -128 -32
WIRE 368 48 368 -32
WIRE -80 80 -128 80
WIRE 416 96 368 96
WIRE -176 112 -224 112
WIRE 320 128 288 128
WIRE 368 160 368 144
WIRE 400 160 368 160
WIRE 368 176 368 160
WIRE -128 208 -128 128
WIRE -128 208 -288 208
WIRE 32 208 -128 208
WIRE 288 208 288 128
WIRE 288 208 32 208
WIRE 416 224 368 224
WIRE 32 240 32 208
WIRE 288 256 288 208
WIRE 320 256 288 256
WIRE 112 288 32 288
WIRE 368 288 368 272
WIRE 416 288 416 224
WIRE 416 288 368 288
WIRE -16 320 -80 320
WIRE 368 320 368 288
WIRE -288 368 -288 208
WIRE -240 416 -288 416
WIRE -336 448 -400 448
WIRE 32 496 32 336
WIRE -288 528 -288 464
WIRE -240 528 -240 416
WIRE -240 528 -288 528
WIRE 80 544 32 544
WIRE -16 576 -80 576
WIRE -288 656 -288 528
WIRE 32 656 32 592
WIRE 32 656 -288 656
WIRE 80 656 80 544
WIRE 80 656 32 656
WIRE 112 656 112 288
WIRE 112 656 80 656
WIRE 80 688 80 656
FLAG -80 576 G0
IOPIN -80 576 In
FLAG -80 320 P1
IOPIN -80 320 In
FLAG -208 -256 Vdd
IOPIN -208 -256 In
FLAG 80 688 0
FLAG 368 -32 Vdd
IOPIN 368 -32 In
FLAG 416 96 Vdd
IOPIN 416 96 In
FLAG 400 160 G2
IOPIN 400 160 Out
FLAG 368 320 0
FLAG -400 448 G1
IOPIN -400 448 In
FLAG 96 -80 Vdd
IOPIN 96 -80 In
FLAG -368 -48 G0
IOPIN -368 -48 In
FLAG -224 -80 Vdd
IOPIN -224 -80 In
FLAG -224 112 G1
IOPIN -224 112 In
FLAG -80 80 Vdd
IOPIN -80 80 In
FLAG -64 -48 P1
IOPIN -64 -48 In
SYMBOL nmos4 -16 496 R0
SYMATTR InstName M1
SYMATTR Value2 l=45n w=90n
SYMBOL nmos4 -16 240 R0
SYMATTR InstName M3
SYMATTR Value2 l=45n w=90n
SYMBOL pmos4 320 48 R0
SYMATTR InstName M10
SYMATTR Value2 l=45n w=90n
SYMBOL nmos4 320 176 R0
SYMATTR InstName M11
SYMATTR Value2 l=45n w=45n
SYMBOL nmos4 -336 368 R0
SYMATTR InstName M8
SYMATTR Value2 l=45n w=45n
SYMBOL pmos4 0 -128 R0
SYMATTR InstName M4
SYMATTR Value2 l=45n w=180n
SYMBOL pmos4 -320 -128 R0
SYMATTR InstName M5
SYMATTR Value2 l=45n w=180n
SYMBOL pmos4 -176 32 R0
SYMATTR InstName M2
SYMATTR Value2 l=45n w=180n
TEXT -88 760 Left 2 !.INCLUDE 45nm_bulk.pm

The netlist it stands for:
* final_symbol_kogge_schematic.asc
V1 VDD 0 1
V2 A8 0 PULSE(0 1 10n 1p 1p 10n 20n 10)
V3 A7 0 PULSE(0 1 5n 1p 1p 5n 10n 10)
V4 A6 0 PULSE(0 1 10n 1p 1p 10n 20n 10)
V5 A5 0 PULSE(0 1 5n 1p 1p 5n 10n 10)
V6 A4 0 PULSE(0 1 10n 1p 1p 10n 20n 10)
V7 A3 0 PULSE(0 1 5n 1p 1p 5n 10n 10)
V8 A2 0 PULSE(0 1 10n 1p 1p 10n 20n 10)
V9 A1 0 PULSE(0 1 5n 1p 1p 5n 10n 10)
V10 B8 0 PULSE(0 1 20n 1p 1p 20n 40n 10)
V11 B7 0 PULSE(0 1 10n 1p 1p 10n 20n 10)
V12 B6 0 PULSE(0 1 20n 1p 1p 20n 40n 10)
V13 B5 0 PULSE(0 1 10n 1p 1p 10n 20n 10)
V14 B4 0 PULSE(0 1 20n 1p 1p 20n 40n 10)
V15 B3 0 PULSE(0 1 10n 1p 1p 10n 20n 10)
V16 B2 0 PULSE(0 1 20n 1p 1p 20n 40n 10)
V17 B1 0 PULSE(0 1 10n 1p 1p 10n 20n 10)
V18 C 0 1
X8_bit_kogge_stone A1 A2 A3 A4 A5 A6 A7 A8 B1 B2 B3 B4 B5 B6 B7 B8 C VDD Cout S1 S2 S3 S4 S5 S6 S7 S8 8bit_kogge_stone_final

* block symbol definitions
.subckt 8bit_kogge_stone_final A1 A2 A3 A4 A5 A6 A7 A8 B1 B2 B3 B4 B5 B6 B7 B8 C VDD Cout S1 S2 S3 S4 S5 S6 S7 S8
XX1 A1 B1 VDD N006 p1 bit_prop_gen
XX2 A2 B2 VDD N008 p2 bit_prop_gen
XX3 A3 B3 VDD N005 p3 bit_prop_gen
XX4 A4 B4 VDD N007 p4 bit_prop_gen
XX5 A5 B5 VDD N004 p5 bit_prop_gen
XX6 A6 B6 VDD N003 p6 bit_prop_gen
XX7 A7 B7 VDD N002 p7 bit_prop_gen
XX8 A8 B8 VDD N001 p8 bit_prop_gen
XX10 N006 N008 p1 p2 VDD N021 N016 group_prop_generate_both
XX11 N008 N005 p2 p3 VDD N018 N015 group_prop_generate_both
XX12 N005 N007 p3 p4 VDD N009 N020 group_prop_generate_both
XX13 N007 N004 p4 p5 VDD N012 N014 group_prop_generate_both
XX14 N004 N003 p5 p6 VDD N017 N019 group_prop_generate_both
XX15 N003 N002 p6 p7 VDD N011 N023 group_prop_generate_both
XX16 N002 N001 p7 p8 VDD N013 N022 group_prop_generate_both
XX17 N021 N009 N016 N020 VDD N033 N032 group_prop_generate_both
XX18 N018 N012 N015 N014 VDD N031 N030 group_prop_generate_both
XX19 N009 N017 N020 N019 VDD N029 N028 group_prop_generate_both
XX20 N012 N011 N014 N023 VDD N027 N024 group_prop_generate_both
XX21 N017 N013 N019 N022 VDD N026 N034 group_prop_generate_both
XX22 N033 N026 N032 N034 VDD N038 N037 group_prop_generate_both
XX23 C p1 VDD S1 xor_post_comp_sum
XX24 N010 p2 VDD S2 xor_post_comp_sum
XX25 p3 G VDD S3 xor_post_comp_sum
XX26 p4 N025 VDD S4 xor_post_comp_sum
XX27 p5 N040 VDD S5 xor_post_comp_sum
XX28 p6 N036 VDD S6 xor_post_comp_sum
XX29 p7 N039 VDD S7 xor_post_comp_sum
XX30 N035 p8 VDD S8 xor_post_comp_sum
XX9 C N006 p1 VDD N010 group_generation
XX31 C N021 N016 VDD G group_generation
XX32 N010 N018 N015 VDD N025 group_generation
XX36 C N033 N032 VDD N040 group_generation
XX37 N010 N031 N030 VDD N036 group_generation
XX38 G N029 N028 VDD N039 group_generation
XX39 N025 N027 N024 VDD N035 group_generation
XX40 C N038 N037 VDD Cout group_generation
C1 S1 0 10f
C2 S2 0 10f
C3 S3 0 10f
C4 S4 0 10f
C5 S5 0 10f
C6 S6 0 10f
C7 S7 0 10f
C8 S8 0 10f
C9 Cout 0 10f
.INCLUDE 45nm_bulk.pm
.ends 8bit_kogge_stone_final

.subckt bit_prop_gen A B Vdd gi pi
M5 N003 B 0 0 NMOS l=45n w=90n
M14 Vdd A N002 Vdd PMOS l=45n w=90n
M15 N002 A N003 0 NMOS l=45n w=90n
M20 Vdd N002 gi Vdd PMOS l=45n w=90n
M19 gi N002 0 0 NMOS l=45n w=45n
M1 Vdd B N002 Vdd PMOS l=45n w=90n
M2 Vdd B B_bar Vdd PMOS l=45n w=90n
M3 B_bar B 0 0 NMOS l=45n w=45n
M4 Vdd A A_bar Vdd PMOS l=45n w=90n
M6 A_bar A 0 0 NMOS l=45n w=45n
M7 N004 B_bar 0 0 NMOS l=45n w=90n
M8 N001 A pi Vdd PMOS l=45n w=180n
M9 pi A_bar N004 0 NMOS l=45n w=90n
M10 N001 B pi Vdd PMOS l=45n w=180n
M11 N005 B 0 0 NMOS l=45n w=90n
M12 pi A N005 0 NMOS l=45n w=90n
M13 Vdd B_bar N001 Vdd PMOS l=45n w=180n
M16 Vdd A_bar N001 Vdd PMOS l=45n w=180n
.INCLUDE 45nm_bulk.pm
.ends bit_prop_gen

.subckt group_prop_generate_both G0 G1 P0 P1 Vdd G2 P2
M9 N004 G0 0 0 NMOS l=45n w=90n
M10 N002 P1 N004 0 NMOS l=45n w=90n
M11 Vdd N002 G2 Vdd PMOS l=45n w=90n
M12 G2 N002 0 0 NMOS l=45n w=45n
M19 N002 G1 0 0 NMOS l=45n w=45n
M20 Vdd P1 N001 Vdd PMOS l=45n w=180n
M21 Vdd G0 N001 Vdd PMOS l=45n w=180n
M22 N001 G1 N002 Vdd PMOS l=45n w=180n
M1 N005 P0 0 0 NMOS l=45n w=90n
M2 Vdd P1 N003 Vdd PMOS l=45n w=90n
M3 N003 P1 N005 0 NMOS l=45n w=90n
M4 Vdd N003 P2 Vdd PMOS l=45n w=90n
M5 P2 N003 0 0 NMOS l=45n w=45n
M6 Vdd P0 N003 Vdd PMOS l=45n w=90n
.INCLUDE 45nm_bulk.pm
.ends group_prop_generate_both

.subckt xor_post_comp_sum A B Vdd Sum
M1 N002 B_bar 0 0 NMOS l=45n w=90n
M2 N001 A Sum Vdd PMOS l=45n w=180n
M3 Sum A_bar N002 0 NMOS l=45n w=90n
M4 N001 B Sum Vdd PMOS l=45n w=180n
M5 N003 B 0 0 NMOS l=45n w=90n
M6 Sum A N003 0 NMOS l=45n w=90n
M7 Vdd B_bar N001 Vdd PMOS l=45n w=180n
M8 Vdd A_bar N001 Vdd PMOS l=45n w=180n
M9 Vdd B B_bar Vdd PMOS l=45n w=90n
M10 B_bar B 0 0 NMOS l=45n w=45n
M11 Vdd A A_bar Vdd PMOS l=45n w=90n
M12 A_bar A 0 0 NMOS l=45n w=45n
.INCLUDE 45nm_bulk.pm
.ends xor_post_comp_sum

.subckt group_generation G0 G1 P1 Vdd G2
M1 N003 G0 0 0 NMOS l=45n w=90n
M3 N002 P1 N003 0 NMOS l=45n w=90n
M10 Vdd N002 G2 Vdd PMOS l=45n w=90n
M11 G2 N002 0 0 NMOS l=45n w=45n
M8 N002 G1 0 0 NMOS l=45n w=45n
M4 Vdd P1 N001 Vdd PMOS l=45n w=180n
M5 Vdd G0 N001 Vdd PMOS l=45n w=180n
M2 N001 G1 N002 Vdd PMOS l=45n w=180n
.INCLUDE 45nm_bulk.pm
.ends group_generation

.model NMOS NMOS
.model PMOS PMOS
.lib standard.mos
.INCLUDE 45nm_bulk.pm
.tran 100n
.backanno
.end